# Altium schematic sheet boost__.SchDoc
size A4
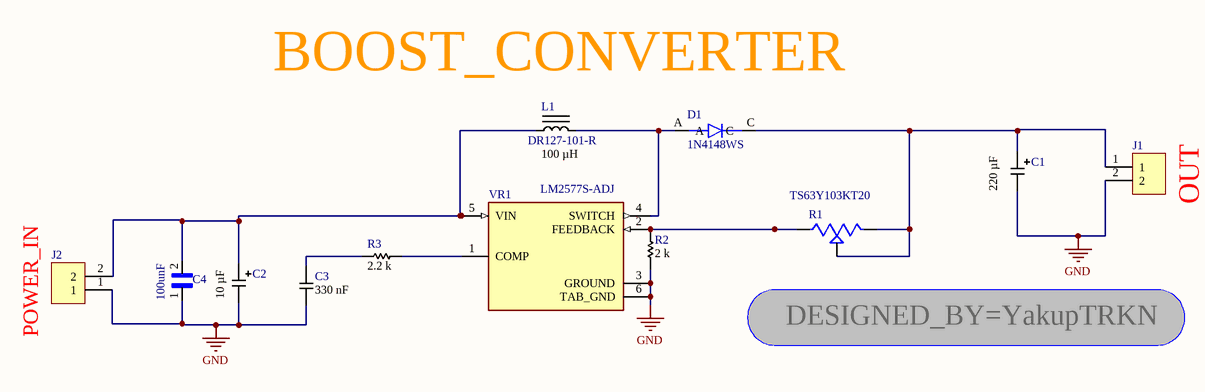
[diagram p0: boost__.SchDoc]

## Parts
C1  Capacitance: 220 µF  [KYOCERA_CAP_TAN-C]  (hidden comment: TAJC227M010RNJ)
C2  Capacitance: 10 µF  [KEMET_CAP_TAN-B]  (hidden comment: T491B106M016AT)
C3  Capacitance: 330 nF  [SAMSUNG_CAP_0805_095]  (hidden comment: CL21B334KOCNNNC)
C4  100unF  [CAPC1608X92N]
D1  1N4148WS  [SODFL2512X100N]
J1  OUT  [Klemens 1x2 - 3.5mm]
J2  POWER_IN  [Klemens 1x2 - 3.5mm]
L1  DR127-101-R  Inductance: 100 µH  [EATON_DR127]
R1  TS63Y103KT20  [TRIM_TS63Y103KT20]
R2  Resistance: 2 k  [ROYALOHM_RES_0603]  (hidden comment: 0603SAJ0202T5E)
R3  Resistance: 2.2 k  [ROYALOHM_RES_0805]  (hidden comment: 0805S8J0222T5E)
VR1  LM2577S-ADJ  [TO170P1524X483-6N]

## Nets
GND: C1.2 C2.2 C3.1 C4.1 J1.2 J2.1 R2.2 VR1.3(GROUND) VR1.6(TAB_GND)
NetC1_1: C1.1 D1.C J1.1 R1.2(B) R1.3(C)
NetC2_1: C2.1 C4.2 J2.2 L1.1 VR1.5(VIN)
NetC3_2: C3.2 R3.1
NetD1_A: D1.A L1.2 VR1.4(SWITCH)
NetR1_1: R1.1(A) R2.1 VR1.2(FEEDBACK)
NetR3_2: R3.2 VR1.1(COMP)

## Notes on the sheet
- BOOST_CONVERTER
- DESIGNED_BY=YakupTRKN

## Library data of the parts
C1 = TAJC227M010RNJ: CAP TANT 220UF 20% 10V 2312; Supplier 1: Digi-Key; Supplier 2: Mouser; Supplier 3: Arrow Electronics; Supplier Part Number 3: TAJC227M010RNJ; Supplier Part Number 2: 581-TAJC227M010RNJ; Supplier Part Number 1: 478-8899-1-ND
C2 = T491B106M016AT: CAP TANT 10UF 20% 16V 1411; Supplier 1: Digi-Key; Supplier 2: Farnell; Supplier 3: Mouser; Supplier Part Number 1: 399-3708-1-ND; Supplier Part Number 2: 2462772; Supplier Part Number 3: 80-T491B106M016
C3 = CL21B334KOCNNNC: CAP CER 0.33UF 16V X7R 0805; Supplier 1: Digi-Key; Supplier 2: Mouser; Supplier 3: Arrow Electronics; Supplier Part Number 1: 1276-1797-1-ND; Supplier Part Number 2: 187-CL21B334KOCNNNC; Supplier Part Number 3: CL21B334KOCNNNC
C4 = VJ0603Y104KLXAC5G: Multilayer Ceramic Capacitors MLCC - SMD/SMT 100nF 25volts 10%; MF: {'manufacturer': u'Vishay'}; Package: None; Price: None; Value: *; MP: VJ0603Y104KLXAC5G; Availability: Unavailable
D1 = 1N4148WS: 1N4148WS Series 75 V 300 mA Surface Mount Small Signal Diodes - SOD-323F; MF: {'manufacturer': u'ON'}; Package: None; Value: *; Availability: Unavailable; Price: None; MP: 1N4148WS
J1 J2 = Klemens 1x2 3.5mm
L1 = DR127-101-R: FIXED IND 100UH 1.96A 163 MOHM; Supplier 1: Digi-Key; Supplier 2: Farnell; Supplier 3: Mouser; Supplier 4: Arrow Electronics; Supplier Part Number 1: 513-1038-1-ND; Supplier Part Number 2: 3650504; Supplier Part Number 3: 704-DR127-101-R; Supplier Part Number 4: DR127-101-R
R1 = TS63Y103KT20: MF: {'manufacturer': u'Vishay'}; Package: None; Price: None; Value: *; MP: TS63Y103KT20; Availability: Unavailable
R2 = 0603SAJ0202T5E: RES SMD 2K OHM 5% 1/10W 0603
R3 = 0805S8J0222T5E: RES SMD 2.2K OHM 5% 1/8W 0805
VR1 = LM2577S-ADJ: MF: {'manufacturer': u'Texas Instruments'}; Package: None; Price: None; Value: *; MP: LM2577S-ADJ; Availability: Unavailable